# EAGLE schematic rotaryswitchencoder (EAGLE 9.1.1)
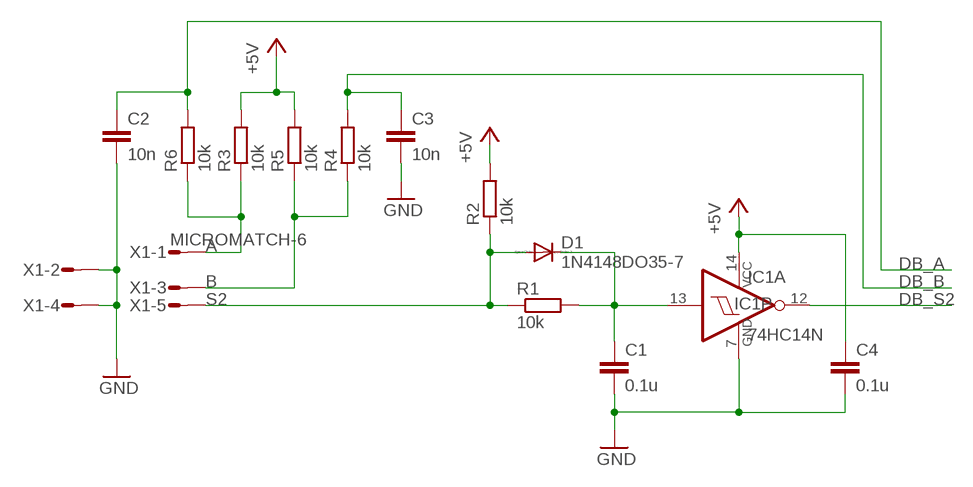
[diagram p0: schematic, sheet 1]

## Parts
C1  0.1u  C-EU050-024X044  [C050-024X044]
C2  10n  C-EU050-024X044  [C050-024X044]
C3  10n  C-EU050-024X044  [C050-024X044]
C4  0.1u  C-EU050-024X044  [C050-024X044]
D1  1N4148DO35-7  [DO35-7]
IC1  74HC14N  [DIL14]
R1  10k  R-EU_0204/7  [0204/7]
R2  10k  R-EU_0204/7  [0204/7]
R3  10k  R-EU_0204/7  [0204/7]
R4  10k  R-EU_0204/7  [0204/7]
R5  10k  R-EU_0204/7  [0204/7]
R6  10k  R-EU_0204/7  [0204/7]
X1  MICROMATCH-6  [MICROMATCH-6]

## Nets
+5V: C4.1 IC1.14(P:VCC) R2.2 R3.2 R5.2
A: R3.1 R6.1 X1.1
B: R4.1 R5.1 X1.3
DB_A: C2.1 R6.2
DB_B: C3.1 R4.2
DB_S2: IC1.12(A:O)
GND: C1.2 C2.2 C3.2 C4.2 IC1.7(P:GND) X1.2 X1.4
N$2: C1.1 D1.C IC1.13(A:I) R1.2
S2: D1.A R1.1 R2.1 X1.5
Unconnected: IC1.1(D:I) IC1.2(D:O) IC1.3(E:I) IC1.4(E:O) IC1.5(F:I) IC1.6(F:O) IC1.8(C:O) IC1.9(C:I) IC1.10(B:O) IC1.11(B:I) X1.6

## Library data of the parts
C1-C4 = rcl:C-EU: CAPACITOR, European symbol; SPICEPREFIX: C
D1 = diode:1N4148: DIODE high speed (Philips)
IC1 = 74xx-eu:74*14: Hex schmitt trigger INVERTER
R1-R6 = resistor:R-EU_: RESISTOR, European symbol
X1 = con-amp-micromatch:MICROMATCH-6: MicroMaTch 6 7-215464-6 / 0-215464-6 Drawing Number C-215464 DDEController.pdf; MPN: 7-215464-6; OC_FARNELL: 3784630; OC_NEWARK: 19R8125